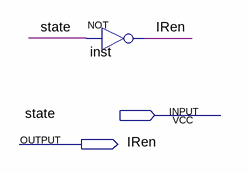
[diagram p0: schematic sheet]
// Quartus schematic controler_ir_enable.bdf as structural Verilog: 1 symbols, 2 pins
module controler_ir_enable (
  input  state,
  output IRen
);

  not inst (IRen, state);
endmodule
